# Altium schematic sheet L7805.SchDoc
size A4
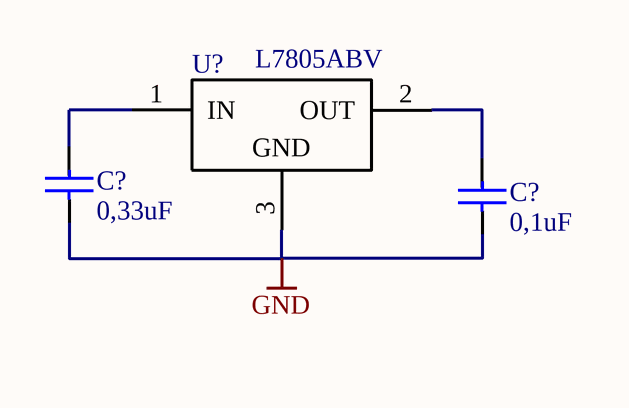
[diagram p0: L7805.SchDoc]

## Parts
(Parts that share a designator on the sheet are numbered #1, #2 ... from top to bottom, then left to right.)
C?#1  value 0,33uF  [C_0805]  (hidden comment: Cap_Semi)
C?#2  value 0,1uF  [C_0805]  (hidden comment: Cap_Semi)
U?  L7805ABV  [TO-220A]

## Nets
GND: C?#1.2 C?#2.2 U?.3(GND)
NetC?#1_1: C?#1.1 U?.1(IN)
NetC?#2_1: C?#2.1 U?.2(OUT)

## Library data of the parts
C?#1 C?#2 = Cap_Semi: Capacitor Semi
U? = L7812ABV: Precision 1A Regulator; Published: 24-Aug-2001; LatestRevisionDate: 17-Jul-2002; LatestRevisionNote: Re-released for DXP Platform.; DatasheetVersion: Nov-1999; PackageVersion: Jun-1998; PackageReference: TO220ABN; Publisher: Altium Limited; PackageDescription: TO, Thru-Hole, Vertical, Heatsink Mounted; 3 In-Line Leads; Pitch 2.54 mm; Pin sequence 1, 3, 2; ComponentLink1Description: Manufacturer Link; ComponentLink1URL: http://www.st.com/; ComponentLink2Description: Datasheet; ComponentLink2URL: http://www.st.com/stonline/products/literature/ds/2144/l7805ab.pdf